# EAGLE schematic Solar_Harvester (EAGLE 6.4)
Booster Pack Challange 2013
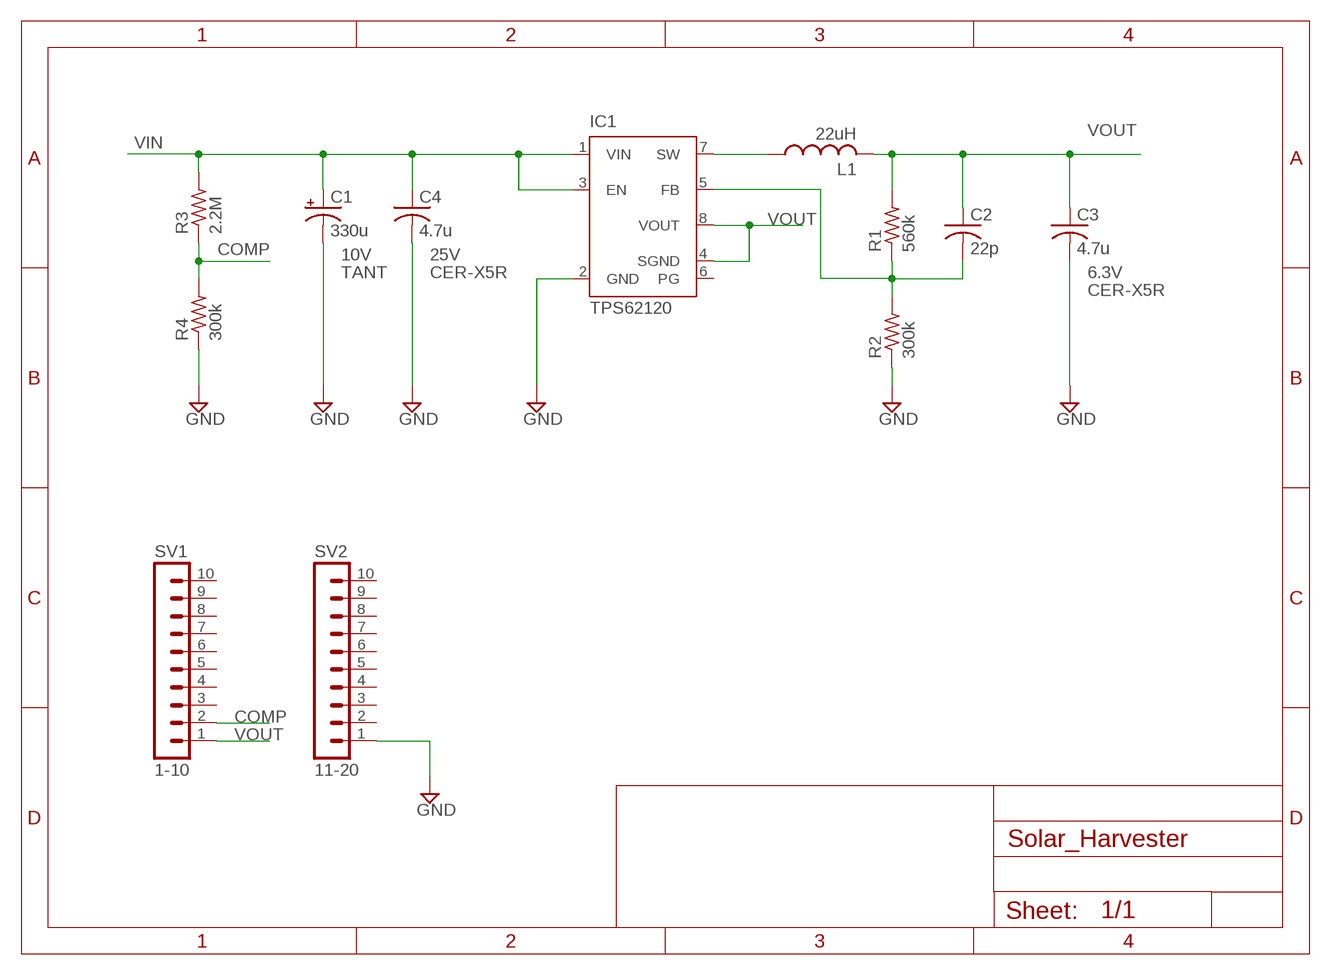
[diagram p0: schematic, sheet 1]

## Parts
C1  330u  CPOL-USCT7343  [CT7343]
C2  22p  C-USC0603K  [C0603K]
C3  4.7u  C-USC0603K  [C0603K]
C4  4.7u  C-USC0805K  [C0805K]
IC1  TPS62120  [DCN-R-PDSO-G8]
L1  22uH  L-USL2825P  [L2825P]
R1  560k  R-US_R0603  [R0603]
R2  300k  R-US_R0603  [R0603]
R3  2.2M  R-US_R0603  [R0603]
R4  300k  R-US_R0603  [R0603]
SV1  1-10  MA10-1  [MA10-1]
SV2  11-20  MA10-1  [MA10-1]

## Nets
COMP: R3.1 R4.2 SV1.2
GND: C1.- C3.2 C4.2 IC1.2(GND) R2.1 R4.1 SV2.1
N$1: IC1.7(SW) L1.1
N$3: C2.2 IC1.5(FB) R1.1 R2.2
VIN: C1.+ C4.1 IC1.1(VIN) IC1.3(EN) R3.2
VOUT: C2.1 C3.1 IC1.4(SGND) IC1.8(VOUT) L1.2 R1.2 SV1.1
Unconnected: IC1.6(PG) SV1.3 SV1.4 SV1.5 SV1.6 SV1.7 SV1.8 SV1.9 SV1.10 SV2.2 SV2.3 SV2.4 SV2.5 SV2.6 SV2.7 SV2.8 SV2.9 SV2.10

## Library data of the parts
C1 = rcl:CPOL-US: POLARIZED CAPACITOR, American symbol; TYPE: TANT; VOLTAGE: 10V
C2 = rcl:C-US: CAPACITOR, American symbol
C3 = rcl:C-US: CAPACITOR, American symbol; TYPE: CER-X5R; VOLTAGE: 6.3V
C4 = rcl:C-US: CAPACITOR, American symbol; TYPE: CER-X5R; VOLTAGE: 25V
IC1 = texas:TPS62120: 15V, 75mA High Efficient Buck Converter Source: tps62120.pdf (www.ti.com)
L1 = rcl:L-US: INDUCTOR, American symbol
R1-R4 = rcl:R-US_: RESISTOR, American symbol
SV1 SV2 = con-lstb:MA10-1: PIN HEADER; OC_FARNELL: unknown; OC_NEWARK: unknown